# Altium schematic sheet main.SchDoc
size A4; SheetNumber: 1; SheetTotal: 1
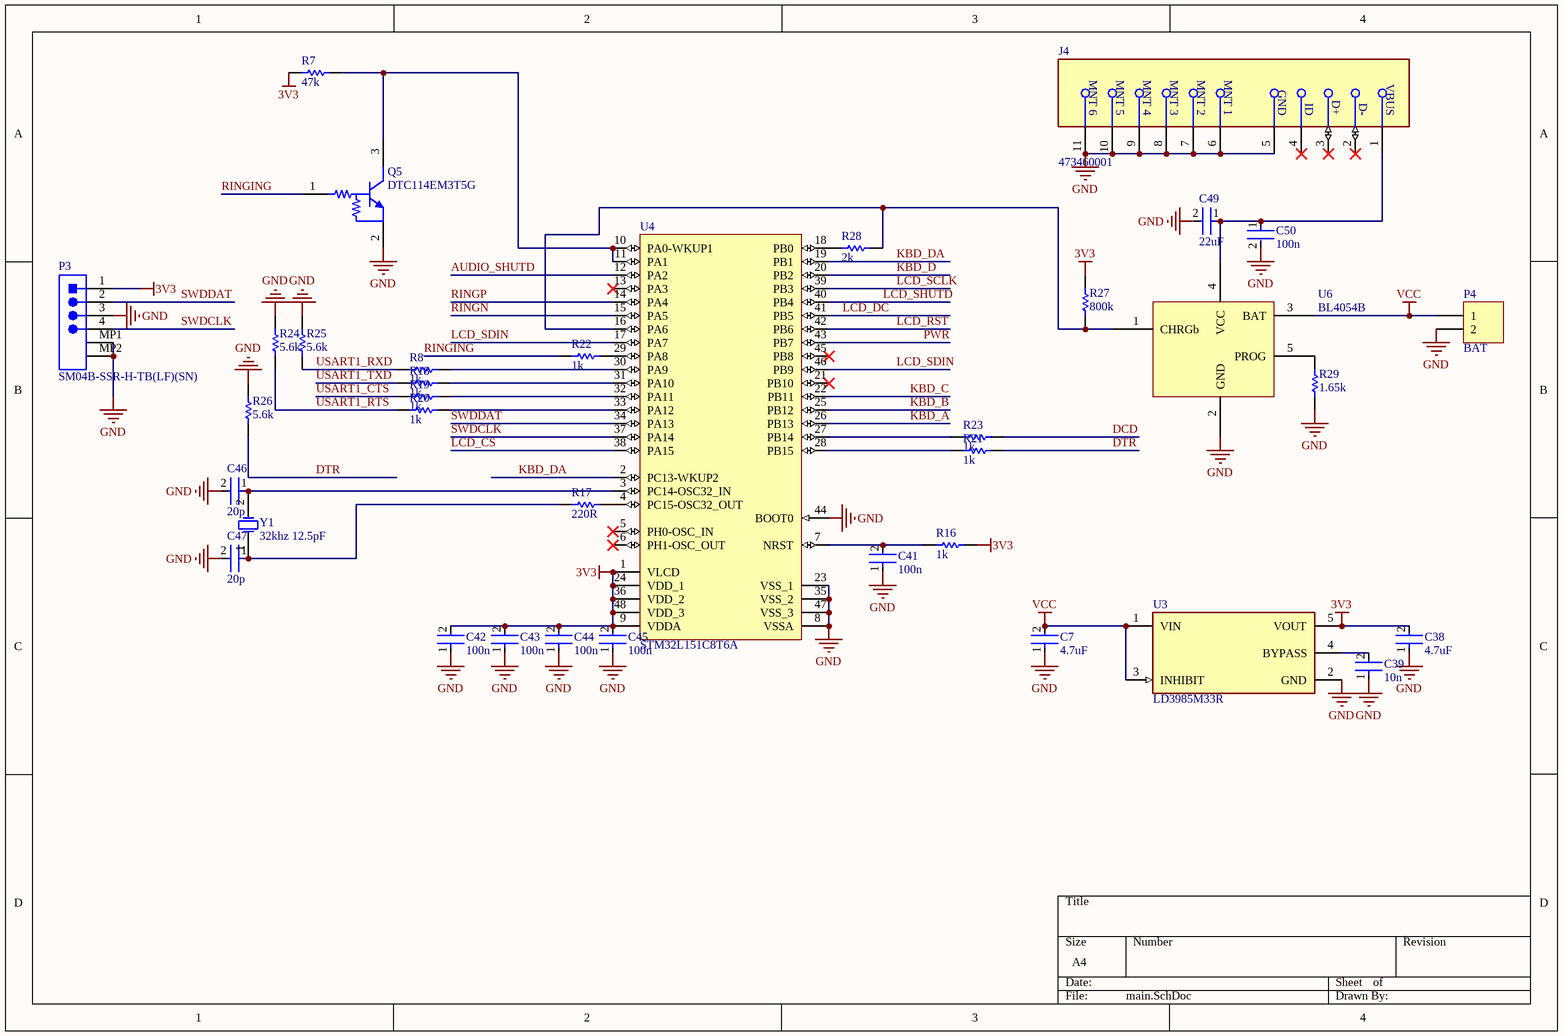
[diagram p0: main.SchDoc]

## Parts
C7  4.7uF  [FP-GRM188-0_1-e0_2_0_55-IPC_A]
C38  4.7uF  [FP-GRM188-0_1-e0_2_0_55-IPC_A]
C39  10n  [FP-GRM155-0_05-IPC_A]
C41  100n  [FP-GRM155-0_05-IPC_A]
C42  100n  [FP-GRM155-0_05-IPC_A]
C43  100n  [FP-GRM155-0_05-IPC_A]
C44  100n  [FP-GRM155-0_05-IPC_A]
C45  100n  [FP-GRM155-0_05-IPC_A]
C46  20p  [FP-GRM155-0_05-IPC_A]
C47  20p  [FP-GRM155-0_05-IPC_A]
C49  22uF  [FP-GRM21B-0_15-MFG]
C50  100n  [FP-GRM155-0_05-IPC_A]
J4  473460001  [FP-473460001-MFG]
P3  SM04B-SSR-H-TB(LF)(SN)  [JST-SM04B-SSR-H-TB_V]
P4  BAT  [HDR1X2]
Q5  DTC114EM3T5G  [ONSC-SOT-723-3-631AA-01_V]
R7  47k  [RESC1005X40X25NL05T10]
R8  1k  [RESC1005X40X25NL05T10]
R16  1k  [RESC1005X40X25NL05T10]
R17  220R  [RESC1005X40X25NL05T10]
R18  1k  [RESC1005X40X25NL05T10]
R19  1k  [RESC1005X40X25NL05T10]
R20  1k  [RESC1005X40X25NL05T10]
R21  1k  [RESC1005X40X25NL05T10]
R22  1k  [RESC1005X40X25NL05T10]
R23  1k  [RESC1005X40X25NL05T10]
R24  5.6k  [RESC1005X40X25NL05T10]
R25  5.6k  [RESC1005X40X25NL05T10]
R26  5.6k  [RESC1005X40X25NL05T10]
R27  800k  [RESC1005X40X25NL05T10]
R28  2k  [RESC1005X40X25NL05T10]
R29  1.65k  [RESC1005X40X25NL05T10]
U3  LD3985M33R  [FP-SOT23-5L-7049676-MFG]
U4  STM32L151C8T6A  [STM-LQFP48_M]
U6  BL4054B  [BL4054B]
Y1  32khz 12.5pF  [YT-26]

## Nets
3V3: C38.2 C42.2 C43.2 C44.2 C45.2 P3.1 R7.2 R16.1 R27.2 U3.5(VOUT) U4.1(VLCD) U4.9(VDDA) U4.24(VDD_1) U4.36(VDD_2) U4.48(VDD_3)
GND: C7.1 C38.1 C39.1 C41.1 C42.1 C43.1 C44.1 C45.1 C46.2 C47.2 C49.2 C50.2 J4.5(GND) J4.6(MNT_1) J4.7(MNT_2) J4.8(MNT_3) J4.9(MNT_4) J4.10(MNT_5) J4.11(MNT_6) P3.3 P3.MP1 P3.MP2 P4.2 Q5.2(E) R24.2 R25.2 R26.2 R29.2 U3.2(GND) U4.8(VSSA) U4.23(VSS_1) U4.35(VSS_2) U4.44(BOOT0) U4.47(VSS_3) U6.2(GND)
VCC: C7.2 P4.1 U3.1(VIN) U3.3(INHIBIT) U6.3(BAT)
AUDIO_SHUTD: U4.12(PA2)
DCD: R23.1
DTR: R21.2 R26.1
KBD_A: U4.26(PB13)
KBD_B: U4.25(PB12)
KBD_C: U4.22(PB11)
KBD_D: U4.20(PB2)
KBD_DA: U4.2(PC13-WKUP2) U4.19(PB1)
LCD_CS: U4.38(PA15)
LCD_DC: U4.41(PB5)
LCD_RST: U4.42(PB6)
LCD_SCLK: U4.39(PB3)
LCD_SDIN: U4.17(PA7) U4.46(PB9)
LCD_SHUTD: U4.40(PB4)
PWR: U4.43(PB7)
RINGING: Q5.1(B) R22.2
RINGN: U4.15(PA5)
RINGP: U4.14(PA4)
SWDCLK: P3.4 U4.37(PA14)
SWDDAT: P3.2 U4.34(PA13)
USART1_CTS: R19.1
USART1_RTS: R20.1 R24.1
USART1_RXD: R8.1 R25.1
USART1_TXD: R18.1
NetC39_2: C39.2 U3.4(BYPASS)
NetC41_2: C41.2 R16.2 U4.7(NRST)
NetC46_1: C46.1 U4.3(PC14-OSC32_IN) Y1.2(OSC2)
NetC47_1: C47.1 R17.1 Y1.1(OSC1)
NetC49_1: C49.1 C50.1 J4.1(VBUS) U6.4(VCC)
NetQ5_3: Q5.3(C) R7.1 U4.10(PA0-WKUP1) U4.11(PA1)
NetR8_2: R8.2 U4.30(PA9)
NetR17_2: R17.2 U4.4(PC15-OSC32_OUT)
NetR18_2: R18.2 U4.31(PA10)
NetR19_2: R19.2 U4.32(PA11)
NetR20_2: R20.2 U4.33(PA12)
NetR21_1: R21.1 U4.28(PB15)
NetR22_1: R22.1 U4.29(PA8)
NetR23_2: R23.2 U4.27(PB14)
NetR27_1: R27.1 R28.1 U4.16(PA6) U6.1(CHRGb)
NetR28_2: R28.2 U4.18(PB0)
NetR29_1: R29.1 U6.5(PROG)

Not connected (* = marked no-connect by the designer): J4 2(D-)* 3(D+)* 4(ID)*; U4 5(PH0-OSC_IN)* 6(PH1-OSC_OUT)* 13(PA3)* 21(PB10)* 45(PB8)*

## Library data of the parts
C7 C38 = CMP-2006-02792-2: Chip Multilayer Ceramic Capacitors for General Purpose, 0603, 10uF, X5R, 15%, 20%, 6.3V; Packaging: Tape and Reel; Voltage Rating (DC): 6.3V; Width: 0.031inch; Termination: SMD/SMT; Dielectric: X5R; Package Quantity: 4000; Voltage Rating: 6.3V; Capacitance: 10uF; Case/Package: 0603; Min Operating Temperature: -55°C; Voltage: 6.3V; Length: 1.6mm; Thickness: 0.035inch; Lead Free: Lead Free; Depth: 0.8mm; Case Code (Imperial): 0603; Max Operating Temperature: 85°C; Material: Ceramic; Height: 0.8mm; Tolerance: 20%; Mount: Surface Mount; REACH SVHC: No SVHC; Radiation Hardening: No; Case Code (Metric): 1608
C39 C41-C47 C50 = CMP-2008-04369-2: Chip Multilayer Ceramic Capacitors for General Purpose, 0402, 470pF, C0G, 30ppm/°C, 5%, 50V; Insulation Resistance: 10GR; Depth: 0.5mm; Voltage Rating: 50V; Packaging: Tape and Reel; Material: Ceramic; Lead Free: Lead Free; Max Operating Temperature: 125°C; Length: 1mm; Min Operating Temperature: -55°C; Height: 0.5mm; Width: 0.5mm; Thickness: 0.022inch; Voltage: 50V; Termination: SMD/SMT; Dielectric Material: Ceramic; REACH SVHC: No SVHC; Voltage Rating (DC): 50V; Package Quantity: 1; Dielectric: C0G; Radiation Hardening: No; Mount: Surface Mount; Case/Package: 0402; Number of Pins: 2; Tolerance: 5%; Temperature Coefficient: 30ppm/°C; Case Code (Metric): 1005; Capacitance: 470pF; Case Code (Imperial): 0402
C49 = CMP-2007-03385-2: Chip Multilayer Ceramic Capacitors for General Purpose, 0805, 22uF, X5R, 15%, 20%, 6.3V; Material: Ceramic; Max Operating Temperature: 85°C; Voltage: 6.3V; Min Operating Temperature: -55°C; Case/Package: 0805; Thickness: 0.053inch; Dielectric: X5R; Packaging: Tape and Reel; Depth: 1.25mm; Termination: SMD/SMT; Voltage Rating (DC): 6.3V; Radiation Hardening: No; Tolerance: 20%; Mount: Surface Mount; Lead Free: Lead Free; Package Quantity: 1; REACH SVHC: No SVHC; Voltage Rating: 6.3V; Capacitance: 22uF; Length: 2mm; Case Code (Imperial): 0805; Case Code (Metric): 2012; Width: 0.049inch; Height: 1.25mm
J4 = CMP-2000-05246-2: CONN RCPT USB2.0 MICRO B SMD R/A; Manufacturer: Molex; Conn Orientation: Right Angle; Is Female: yes; Shielding: true; Pitch: 0.65mm; Number Of Contacts: 5; Voltage Rating: 30V; Current Rating: 1.8A; Device Class L2: USB Connectors; Digikey Description: CONN RCPT USB2.0 MICRO B SMD R/A; Height: 2.945mm; RoHS: TRUE; ComponentLink2Description: Datasheet; Octopart: https://octopart.com/47346-0001-molex-7164928; Automotive: No; Package: 0; Category: Conn; Device Class L1: Connectors; Usb Standard: USB 2.0; Temperature: -30°C to +85°C; Temperature Range Low: -30°C; Footprint Url: https://www.molex.com/pdm_docs/sd/473460001_sd.pdf; ComponentLink2URL: https://www.molex.com/webdocs/datasheets/pdf/en-us/0473460001_IO_CONNECTORS.pdf; Lead Free: Yes; Manufacturer Part Number: 473460001; Contact Material: Gold,Nickel; Temperature Range High: +85°C; Device Class L3: unset
P3 = CMP-2000-07079-1: SSR Connector, Pitch 1 mm, 1 x 4 Position, Height 2 mm, -20 to 85 degC, RoHS, Tape and Reel; Manufacturer: JST; Style/Orientation: Plug; Pitch: 1mm; No of Positions: 4; Datasheet URL: http://www.jst-mfg.com/product/pdf/eng/eSSR.pdf; Package Reference: SM04B-SSR-H-TB; Type: WiretoBoard; Package Description: SSR Connector, Pitch 1 mm, 1 x 4 Position, Height 2 mm; Datasheet Version: 11/2010; Mounting Technology: SurfaceMount; Termination: IDC; Manufacturer URL: http://www.jst.com/home2.html
P4 = Header 2: Header, 2-Pin; LatestRevisionDate: 17-Jul-2002; LatestRevisionNote: Re-released for DXP Platform.; Publisher: Altium Limited
Q5 = CMP-0630-00443-1: Digital Transistor (BRT), R1=10 kOhm, R2=10 kOhm, NPN Transistor, 3-Pin SOT-723, Pb-Free, Tape and Reel; Manufacturer: On Semiconductor; V(BR)CEO Min (V): 50; R1/R2 Typ: 1; IC Continuous (A): 0.1; hFE Min: 35; ComponentLink3Description: Package Specification; Packing: Tape and Reel; ComponentLink1Description: Manufacturer URL; DatasheetVersion: Rev. 5; PackageDescription: 3-Pin Small Outline Transistor, Body 1.2 x 0.8 mm, Pitch 0.4 mm; RoHS: TRUE; Mounting Technology: Surface Mount; ComponentLink2URL: http://www.onsemi.cn/pub_link/Collateral/DTC114E-D.PDF; ComponentLink2Description: Datasheet; ComponentLink1URL: http://www.onsemi.com/; Polarity: NPN; PackageVersion: Rev. D, 08/2009; PartNumber: DTC114EM3T5G; PackageReference: SOT-723-3-631AA-01; ComponentLink3URL: http://www.onsemi.com/pub_link/Collateral/631AA.PDF
R7 R8 R16-R29 = CMP-1011-00001-2: Manufacturer: Yageo / Phycomp; Part Number: RC0402JR-070RL
U3 = CMP-0244-00328-2: IC REG LINEAR 3.3V 150MA SOT23-5; Input Bias Current: 85uA; Output Type: Fixed; Max Input Voltage: 6V; Min Input Voltage: 2.5V; Output Voltage Accuracy: 2%; Quiescent Current: 150uA; Number of Regulators: 1; Min Current Limit: 300mA; Dropout Voltage: 60mV; Polarity: Positive; Min Operating Temperature: -40°C; Height: 1.3mm; Radiation Hardening: No; Package Quantity: 1; Number of Pins: 5; Output Current: 150mA; Width: 1.75mm; Length: 3mm; Mount: Surface Mount; Case/Package: SOT-23; Lead Free: Lead Free; Number of Outputs: 1; Max Operating Temperature: 125°C; Accuracy: 2%; Max Output Current: 150mA; Packaging: Tape and Reel; Output Voltage: 3.3V; Min Output Voltage: 3.3V
U4 = CMP-0236-00182-2: ARM Cortex-M3 32-bit MCU, 64 KB Flash, 32 KB Internal RAM, 37 I/Os, 48-Pin LQFP, -40 to 85 degC, Tray; Manufacturer: STMicroelectronics; FLASH Size (Prog) (kB): 64; Internal RAM Size (kB): 32; Supply Voltage(Vcc) min (V): 1.8; Data E2PROM nom (B): 4096; I/Os (High Current): 37; D/A Converter: 2; ComponentLink2Description: Datasheet; Package Description: 48-Pin Low Profile Quad Flat Package, Body 7 x 7 mm, Pitch 0.5 mm; Mounting Technology: Surface Mount; Package Reference: LQFP48; ComponentLink1Description: Manufacturer URL; Operating Frequency(F) (Processor speed) (MHz): 32; ComponentLink2URL: http://www.st.com/st-web-ui/static/active/en/resource/technical/document/datasheet/DM00078689.pdf; ComponentLink1URL: http://www.st.com/; PartNumber: STM32L151C8T6A; Core: ARM Cortex-M3; DatasheetVersion: Rev. 4; Packing: Tray
U6 = Component_1
Y1 = XTAL: Crystal Oscillator; Published: 8-Jun-2000; LatestRevisionDate: 17-Jul-2002; LatestRevisionNote: Re-released for DXP Platform.; PackageReference: R38; Publisher: Altium Limited; PackageDescription: Crystal, Thru-Hole; 2 Leads; Body 3.1 x 8.2 mm (Dia.xH)